# EAGLE schematic pm (2) (EAGLE 7.5.0)
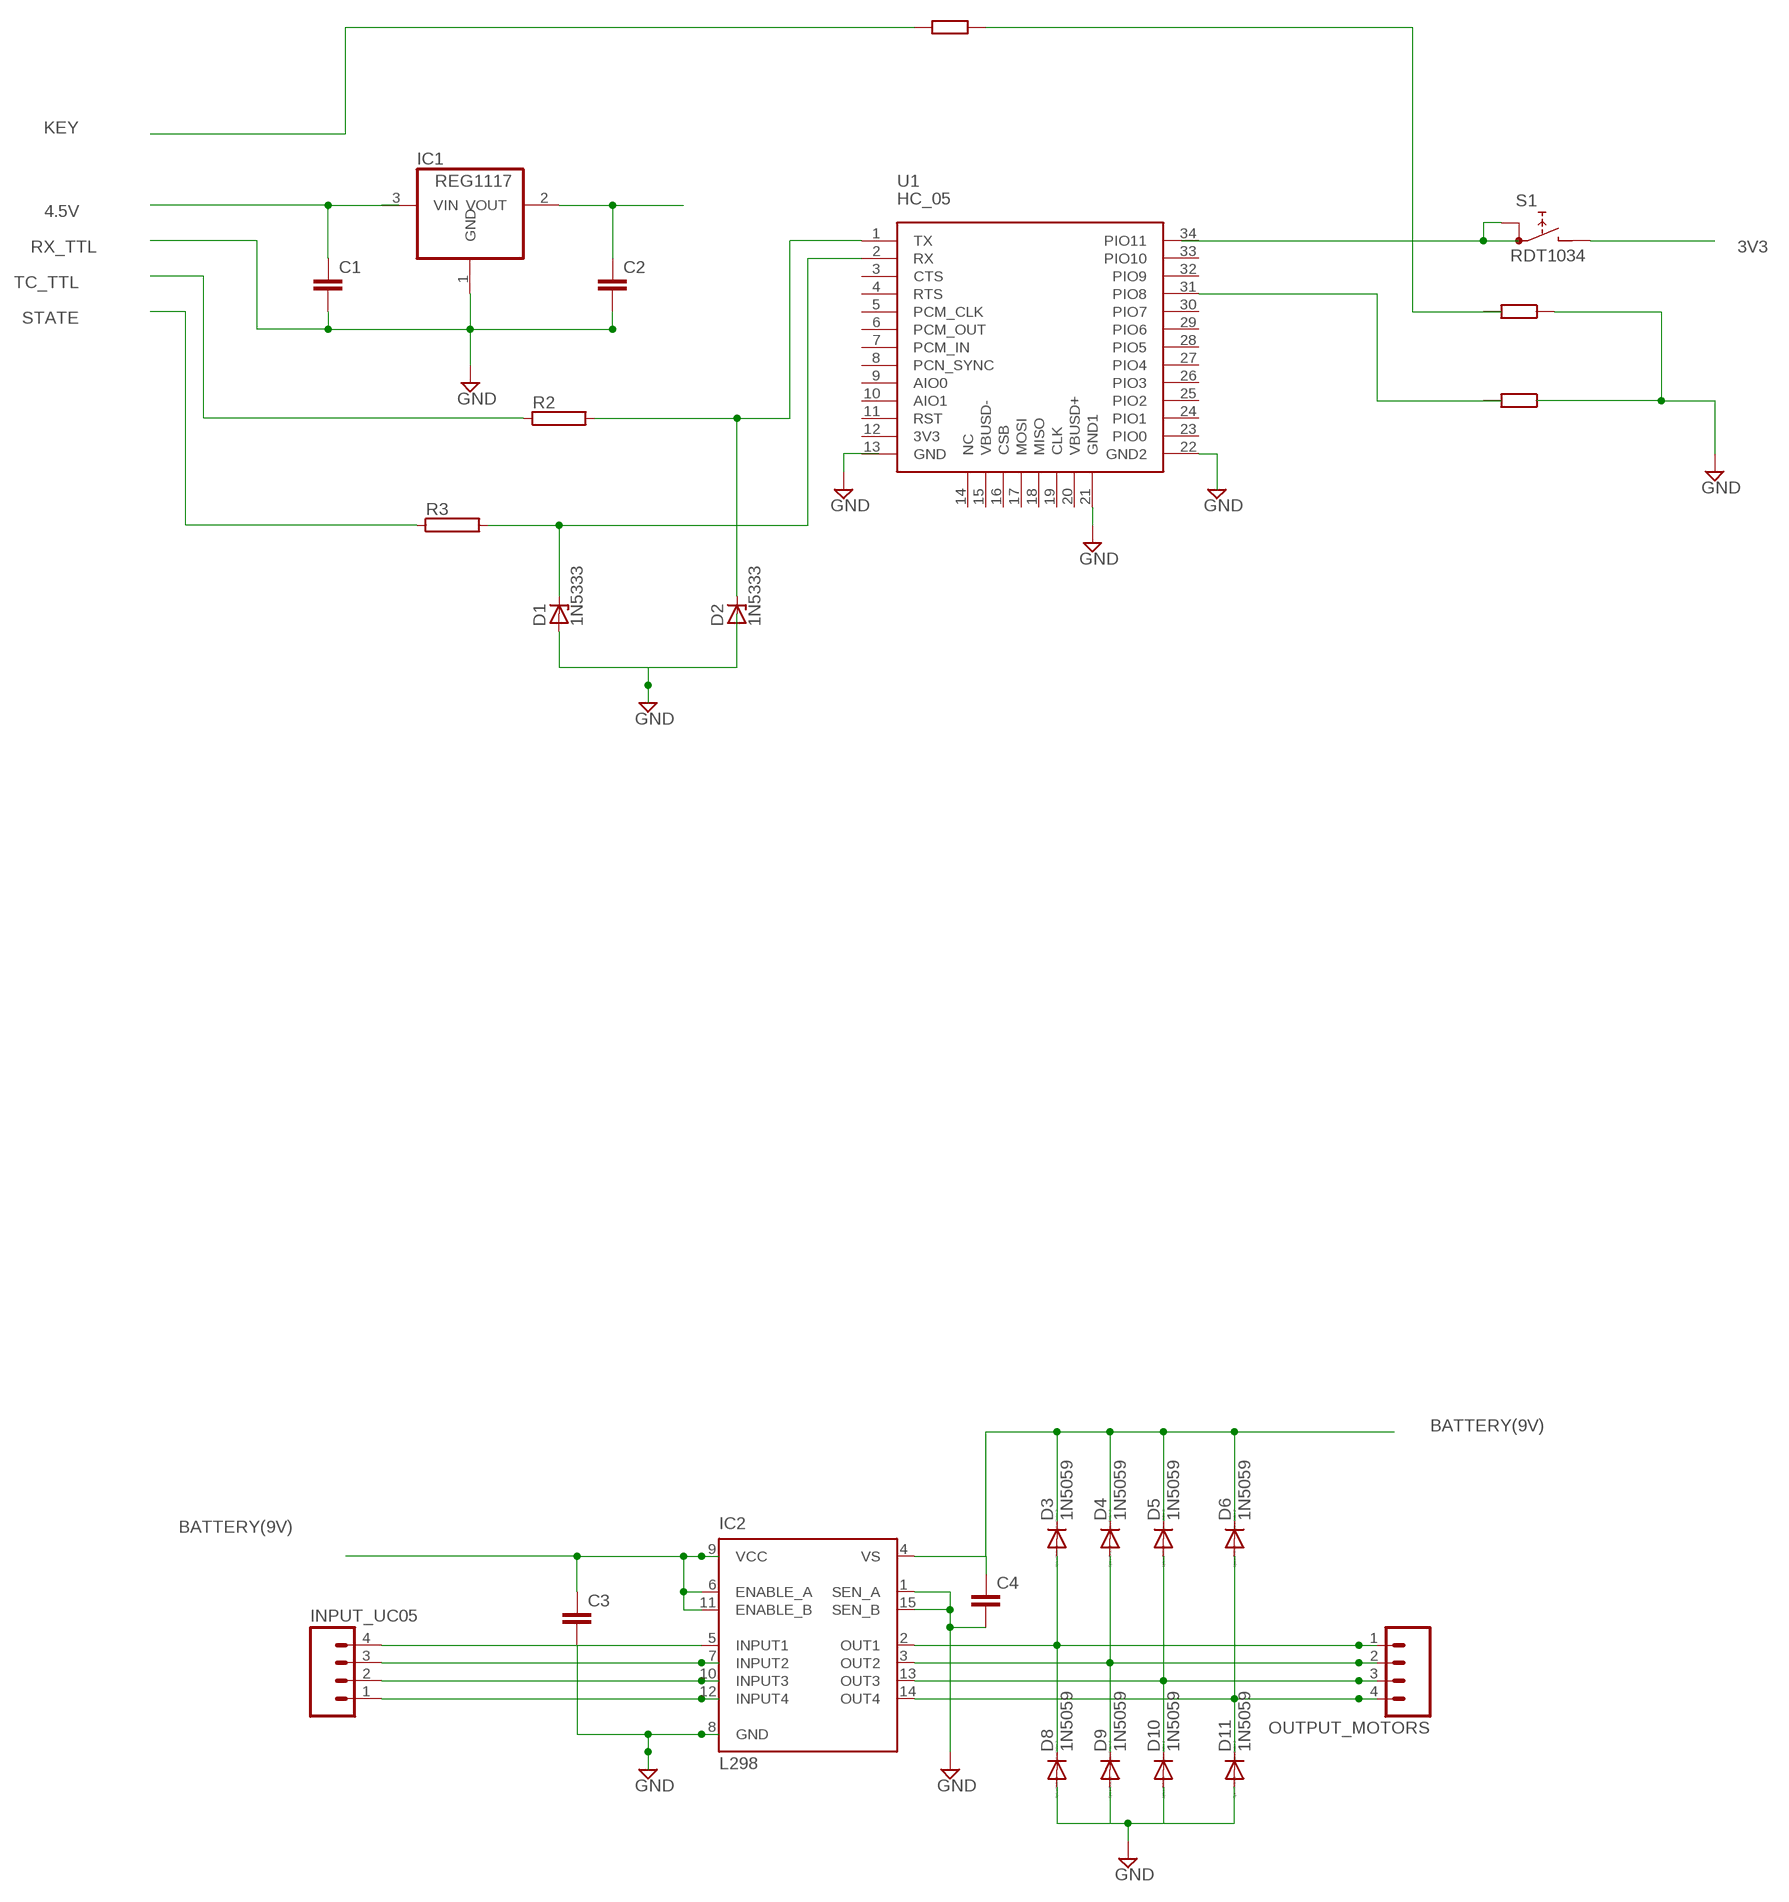
[diagram p0: schematic, sheet 1]

## Parts
C1  C2,5-3  [C2.5-3]
C2  C2,5-3  [C2.5-3]
C3  C2,5-3  [C2.5-3]
C4  C2,5-3  [C2.5-3]
D1  1N5333  [C1702-15]
D2  1N5333  [C1702-15]
D3  1N5059  [DO204-10]
D4  1N5059  [DO204-10]
D5  1N5059  [DO204-10]
D6  1N5059  [DO204-10]
D8  1N5059  [DO204-10]
D9  1N5059  [DO204-10]
D10  1N5059  [DO204-10]
D11  1N5059  [DO204-10]
IC1  REG1117  [SOT223]
IC2  L298  [MULTIWATT-15]
INPUT_UC05  MA04  [04PA]
OUTPUT_MOTORS  MA04  [04PA]
R2  RMG100-H  [TO-247-2H]
R3  RMG100-H  [TO-247-2H]
S1  RDT1034  [RDT1034]
U1  HC_05  [BLUETOOTH_SMD]

## Nets
3V3: S1.B
4.5V: C1.1 IC1.3(VIN)
BATTERY(9V): C3.1 C4.1 D3.C D4.C D5.C D6.C IC2.4(VS) IC2.6(ENABLE_A) IC2.9(VCC) IC2.11(ENABLE_B)
GND: C3.2 C4.2 D1.A D8.A D9.A D10.A D11.A IC2.1(SEN_A) IC2.8(GND) IC2.15(SEN_B) U1.21(GND1)
N$3: U1.22(GND2)
N$4: C2.1 IC1.2(VOUT)
N$5: D2.C R2.2 U1.1(TX)
N$6: D1.C R3.2 U1.2(RX)
N$9: S1.A
N$10: U1.31(PIO8)
N$13: IC2.5(INPUT1) INPUT_UC05.4
N$14: IC2.7(INPUT2) INPUT_UC05.3
N$15: IC2.10(INPUT3) INPUT_UC05.2
N$16: IC2.12(INPUT4) INPUT_UC05.1
N$17: D3.A D8.C IC2.2(OUT1) OUTPUT_MOTORS.1
N$18: D4.A D9.C IC2.3(OUT2) OUTPUT_MOTORS.2
N$19: D5.A D10.C IC2.13(OUT3) OUTPUT_MOTORS.3
N$20: D6.A D11.C IC2.14(OUT4) OUTPUT_MOTORS.4
RX_TTL: C1.2 C2.2 IC1.1(GND) ; supply symbol labelled GND
STATE: R3.1
TC_TTL: R2.1
Unconnected: D2.A S1.A1 U1.3(CTS) U1.4(RTS) U1.5(PCM_CLK) U1.6(PCM_OUT) U1.7(PCM_IN) U1.8(PCN_SYNC) U1.9(AIO0) U1.10(AIO1) U1.11(RST) U1.12(3V3) U1.13(GND) U1.14(NC) U1.15(VBUSD-) U1.16(CSB) U1.17(MOSI) U1.18(MISO) U1.19(CLK) U1.20(VBUSD+) U1.23(PIO0) U1.24(PIO1) U1.25(PIO2) U1.26(PIO3) U1.27(PIO4) U1.28(PIO5) U1.29(PIO6) U1.30(PIO7) U1.32(PIO9) U1.33(PIO10) U1.34(PIO11)

## Library data of the parts
C1-C4 = capacitor-wima:C: CAPACITOR naming: grid - package width
D1 D2 = diode:1N5333: Z DIODE 3.3 V, 5W, 5 percent (Motorola)
D3-D6 D8-D11 = diode:1N5059: DIODE controlled avalanche rectifier
IC1 = burr-brown:REG1117: 800mA and 1A Low Dropout (LDO) Positive Regulator 1.8V, 2.5V, 2.85V, 3.3V, 5V, and Adj; MPN: REG1117; OC_FARNELL: 1097566; OC_NEWARK: 14P6981
IC2 = st-microelectronics:L298: DUAL FULL-BRIDGE DRIVER; MPN: L298N; OC_FARNELL: 1589425; OC_NEWARK: 32M1527
INPUT_UC05 OUTPUT_MOTORS = con-amp-quick:MA04: AMP QUICK CONNECTOR; OC_FARNELL: unknown; OC_NEWARK: unknown
R2 R3 = resistor-power:RMG100: TO-247 Power Resistor - RMG 100 Series Source: www.token.com.tw .. power-resistor-rmg100pdf; OC_FARNELL: unknown; OC_NEWARK: unknown
S1 = switch:RDT1034: PUSH SWITCH www.radiohm.com
U1 = hc-06:HC_05: HC-05 Bluetooth Module